# EAGLE design gt-jtx-2560 (EAGLE 8.2.2)
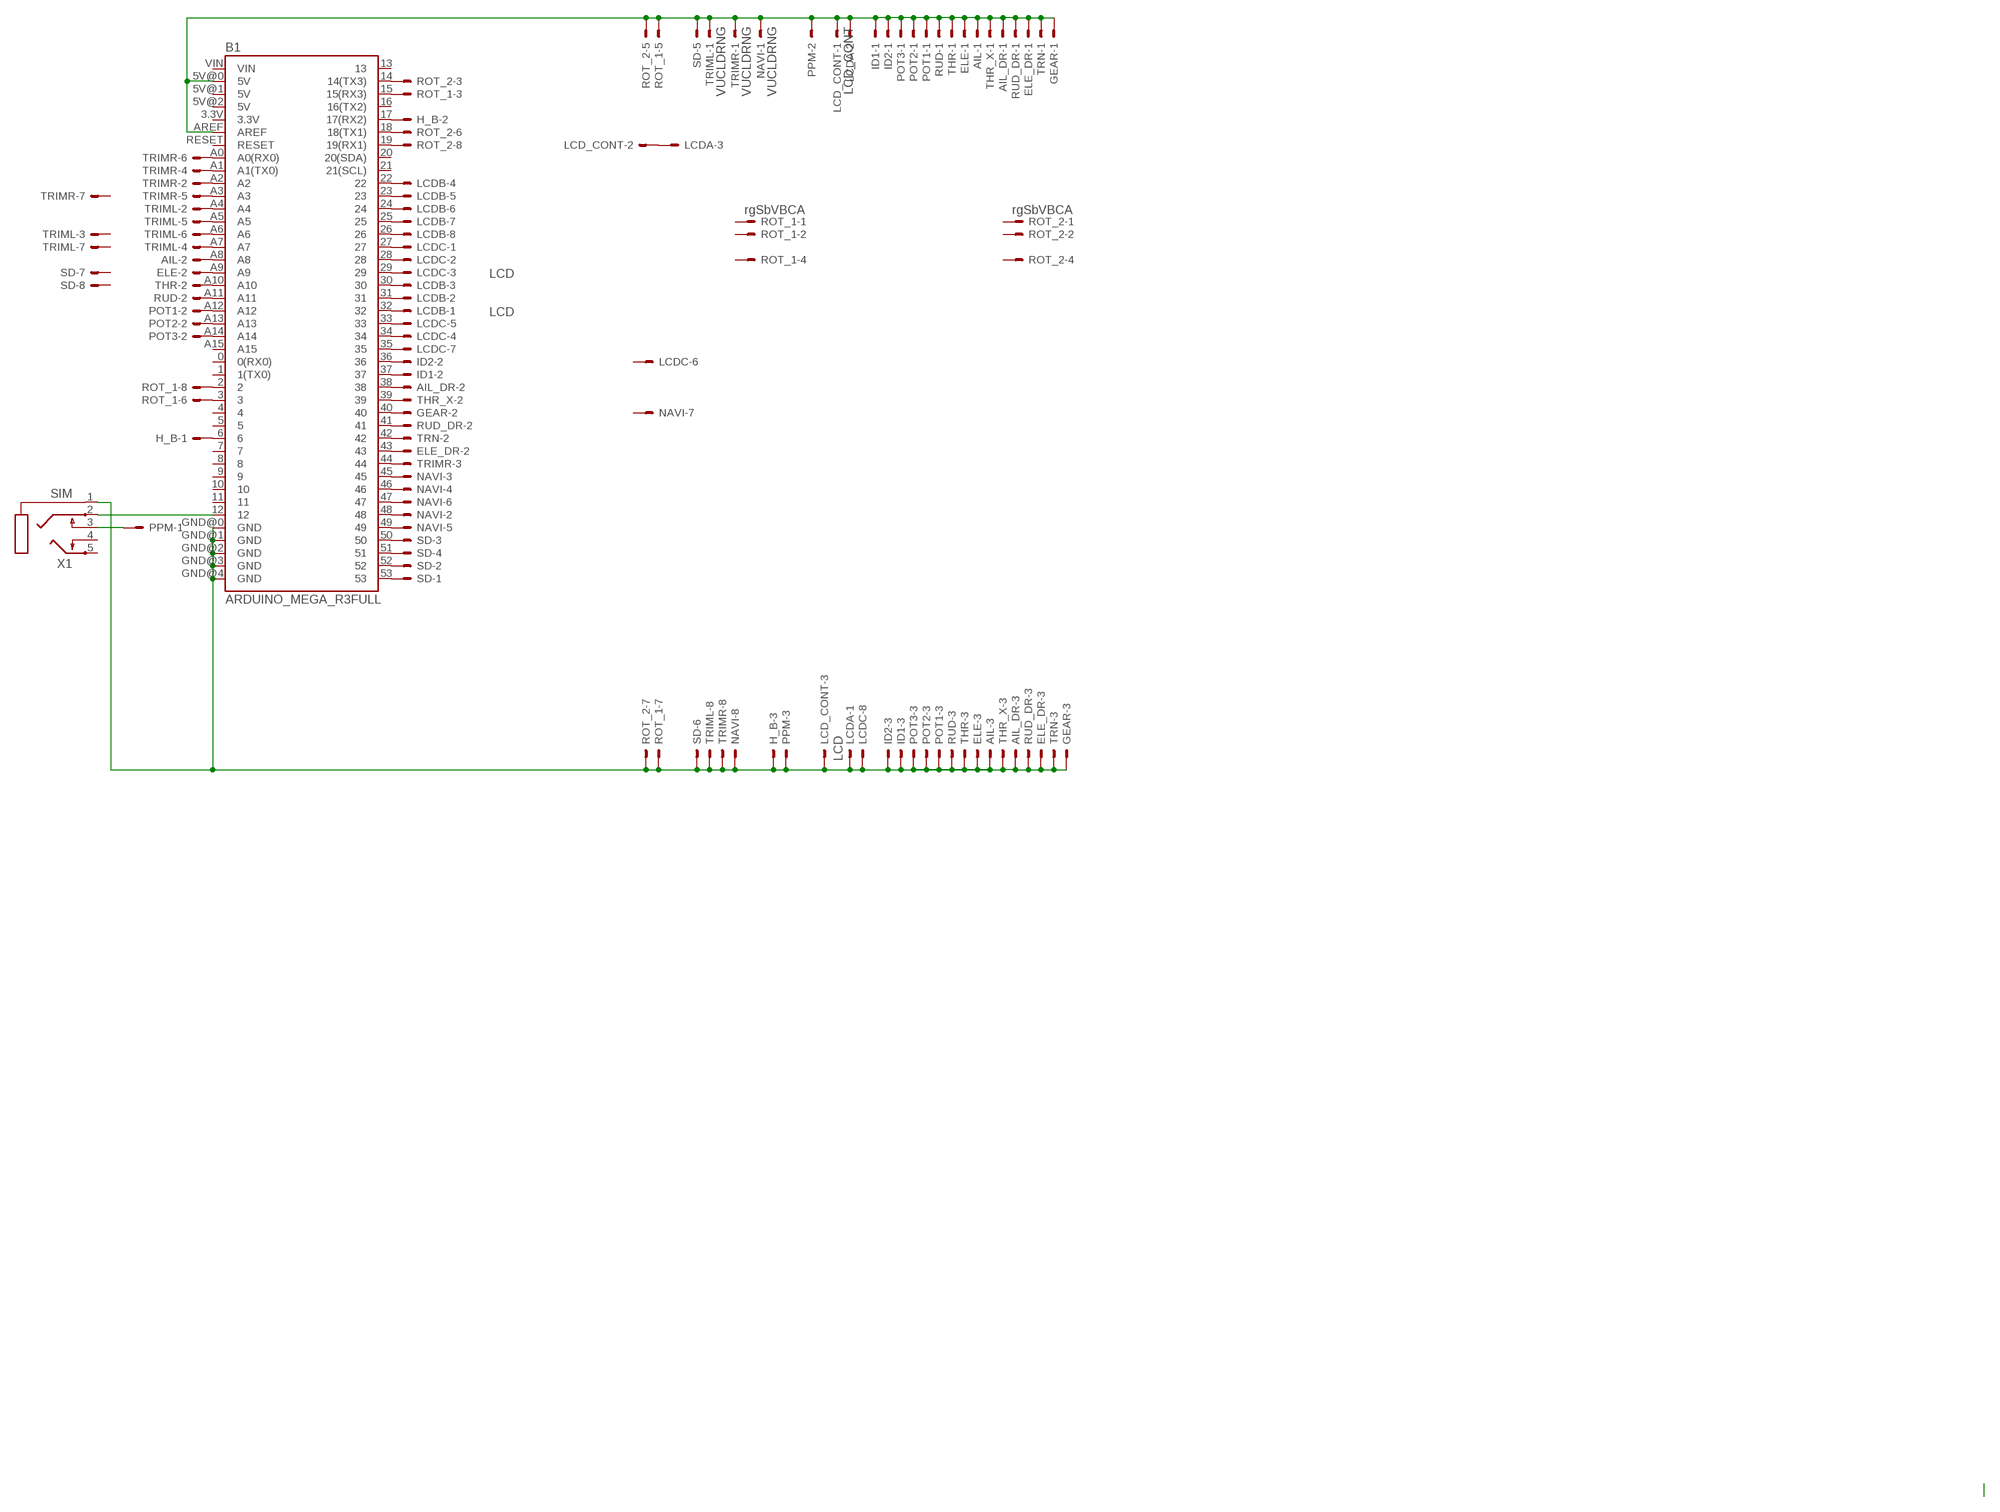
[diagram p0: schematic, sheet 1]

## Parts
AIL  JST-XH-03-PIN-LONG-PAD  [JST-XH-03-PACKAGE-LONG-PAD]
AIL_DR  JST-XH-03-PIN-LONG-PAD  [JST-XH-03-PACKAGE-LONG-PAD]
B1  ARDUINO_MEGA_R3FULL  [ARDUINO_MEGA]
ELE  JST-XH-03-PIN-LONG-PAD  [JST-XH-03-PACKAGE-LONG-PAD]
ELE_DR  JST-XH-03-PIN-LONG-PAD  [JST-XH-03-PACKAGE-LONG-PAD]
GEAR  JST-XH-03-PIN-LONG-PAD  [JST-XH-03-PACKAGE-LONG-PAD]
H_B  JST-XH-03-PIN-LONG-PAD  [JST-XH-03-PACKAGE-LONG-PAD]
ID1  JST-XH-03-PIN-LONG-PAD  [JST-XH-03-PACKAGE-LONG-PAD]
ID2  JST-XH-03-PIN-LONG-PAD  [JST-XH-03-PACKAGE-LONG-PAD]
LCD_CONT  LCD_CONT  JST-XH-03-PIN-LONG-PAD  [JST-XH-03-PACKAGE-LONG-PAD]
LCDA  LCD  JST-XH-03-PIN-LONG-PAD  [JST-XH-03-PACKAGE-LONG-PAD]
LCDB  LCD  JST-XH-08-PIN-LONG-PAD  [JST-XH-08-PACKAGE-LONG-PAD]
LCDC  LCD  JST-XH-08-PIN-LONG-PAD  [JST-XH-08-PACKAGE-LONG-PAD]
NAVI  VUCLDRNG  JST-XH-08-PIN-LONG-PAD  [JST-XH-08-PACKAGE-LONG-PAD]
POT1  JST-XH-03-PIN-LONG-PAD  [JST-XH-03-PACKAGE-LONG-PAD]
POT2  JST-XH-03-PIN-LONG-PAD  [JST-XH-03-PACKAGE-LONG-PAD]
POT3  JST-XH-03-PIN-LONG-PAD  [JST-XH-03-PACKAGE-LONG-PAD]
PPM  JST-XH-03-PIN-LONG-PAD  [JST-XH-03-PACKAGE-LONG-PAD]
ROT_1  rgSbVBCA  JST-XH-08-PIN-LONG-PAD  [JST-XH-08-PACKAGE-LONG-PAD]
ROT_2  rgSbVBCA  JST-XH-08-PIN-LONG-PAD  [JST-XH-08-PACKAGE-LONG-PAD]
RUD  JST-XH-03-PIN-LONG-PAD  [JST-XH-03-PACKAGE-LONG-PAD]
RUD_DR  JST-XH-03-PIN-LONG-PAD  [JST-XH-03-PACKAGE-LONG-PAD]
SD  JST-XH-08-PIN-LONG-PAD  [JST-XH-08-PACKAGE-LONG-PAD]
THR  JST-XH-03-PIN-LONG-PAD  [JST-XH-03-PACKAGE-LONG-PAD]
THR_X  JST-XH-03-PIN-LONG-PAD  [JST-XH-03-PACKAGE-LONG-PAD]
TRIML  VUCLDRNG  JST-XH-08-PIN-LONG-PAD  [JST-XH-08-PACKAGE-LONG-PAD]
TRIMR  VUCLDRNG  JST-XH-08-PIN-LONG-PAD  [JST-XH-08-PACKAGE-LONG-PAD]
TRN  JST-XH-03-PIN-LONG-PAD  [JST-XH-03-PACKAGE-LONG-PAD]
X1  SIM  STEREOJACK  [STX3100]

## Nets
GND: AIL.3 AIL_DR.3 B1.GND@0(GND) B1.GND@1(GND) B1.GND@2(GND) B1.GND@3(GND) B1.GND@4(GND) ELE.3 ELE_DR.3 GEAR.3 H_B.3 ID1.3 ID2.3 LCD_CONT.3 LCDA.1 LCDC.8 NAVI.8 POT1.3 POT2.3 POT3.3 PPM.3 ROT_1.7 ROT_2.7 RUD.3 RUD_DR.3 SD.6 THR.3 THR_X.3 TRIML.8 TRIMR.8 TRN.3 X1.1
N$1: B1.22 LCDB.4
N$2: B1.23 LCDB.5
N$3: B1.24 LCDB.6
N$4: B1.25 LCDB.7
N$5: B1.26 LCDB.8
N$6: B1.27 LCDC.1
N$7: B1.28 LCDC.2
N$8: B1.29 LCDC.3
N$9: B1.48 NAVI.2
N$10: B1.45 NAVI.3
N$11: B1.46 NAVI.4
N$12: B1.49 NAVI.5
N$13: B1.47 NAVI.6
N$14: B1.A2 TRIMR.2
N$15: B1.A7 TRIML.4
N$16: B1.53 SD.1
N$17: B1.A5 TRIML.5
N$18: B1.44 TRIMR.3
N$19: AIL.2 B1.A8
N$20: B1.A9 ELE.2
N$21: B1.A10 THR.2
N$22: B1.A11 RUD.2
N$23: B1.A12 POT1.2
N$24: B1.A13 POT2.2
N$25: B1.A14 POT3.2
N$26: B1.52 SD.2
N$27: B1.A1(A1(TX0)) TRIMR.4
N$28: B1.A3 TRIMR.5
N$29: B1.50 SD.3
N$30: B1.51 SD.4
N$31: B1.15(15(RX3)) ROT_1.3
N$32: B1.6 H_B.1
N$33: B1.39 THR_X.2
N$34: B1.41 RUD_DR.2
N$35: B1.43 ELE_DR.2
N$36: AIL_DR.2 B1.38
N$37: B1.42 TRN.2
N$38: B1.40 GEAR.2
N$39: B1.12 X1.2
N$41: B1.17(17(RX2)) H_B.2
N$42: B1.A0(A0(RX0)) TRIMR.6
N$43: B1.30 LCDB.3
N$44: B1.31 LCDB.2
N$45: B1.A6 TRIML.6
N$46: B1.A4 TRIML.2
N$47: B1.14(14(TX3)) ROT_2.3
N$48: B1.2 ROT_1.8
N$49: B1.3 ROT_1.6
N$50: B1.19(19(RX1)) ROT_2.8
N$51: B1.18(18(TX1)) ROT_2.6
N$52: B1.32 LCDB.1
N$53: B1.34 LCDC.4
N$54: B1.33 LCDC.5
N$55: B1.35 LCDC.7
N$56: LCD_CONT.2 LCDA.3
N$57: PPM.1 X1.3
N$59: B1.36 ID2.2
N$60: B1.37 ID1.2
VCC: AIL.1 AIL_DR.1 B1.5V@0(5V) B1.AREF ELE.1 ELE_DR.1 GEAR.1 ID1.1 ID2.1 LCD_CONT.1 LCDA.2 NAVI.1 POT1.1 POT2.1 POT3.1 PPM.2 ROT_1.5 ROT_2.5 RUD.1 RUD_DR.1 SD.5 THR.1 THR_X.1 TRIML.1 TRIMR.1 TRN.1
Unconnected: B1.0(0(RX0)) B1.1(1(TX0)) B1.3.3V B1.4 B1.5 B1.5V@1(5V) B1.5V@2(5V) B1.7 B1.8 B1.9 B1.10 B1.11 B1.13 B1.16(16(TX2)) B1.20(20(SDA)) B1.21(21(SCL)) B1.A15 B1.RESET B1.VIN LCDC.6 NAVI.7 ROT_1.1 ROT_1.2 ROT_1.4 ROT_2.1 ROT_2.2 ROT_2.4 SD.7 SD.8 TRIML.3 TRIML.7 TRIMR.7 X1.4 X1.5

## Library data of the parts
AIL AIL_DR ELE ELE_DR GEAR H_B ID1 ID2 LCD_CONT LCDA POT1-POT3 PPM RUD RUD_DR THR THR_X TRN = Rembrandt Electronics - JST XH Connectors v1-0:JST-XH-03-PIN: JST XH Connector 2 Pin Wire to board connector. Pitch: 2,54 mm, (0.100") Number of pins: 3 Created by Rembrandt Electronics www.rembrandtelectronics.com
B1 = SparkFun-Boards:ARDUINO_MEGA_R3: Arduino Mega R3 ATmega2560 R3 compatible footprint. SparkFun Products: Arduino Mega 2560 R3 <https://www.sparkfun.com/products/11061>
LCDB LCDC NAVI ROT_1 ROT_2 SD TRIML TRIMR = Rembrandt Electronics - JST XH Connectors v1-0:JST-XH-08-PIN: JST XH Connector 2 Pin Wire to board connector. Pitch: 2,54 mm, (0.100") Number of pins: 8 Created by Rembrandt Electronics www.rembrandtelectronics.com
X1 = adafruit:STEREOJACK: MIC/HEADPHONE JACK Stereo jack with two switches. Kycon STX3100, CUI SJ1-3555NG and/or 4UCon 05544

## Board
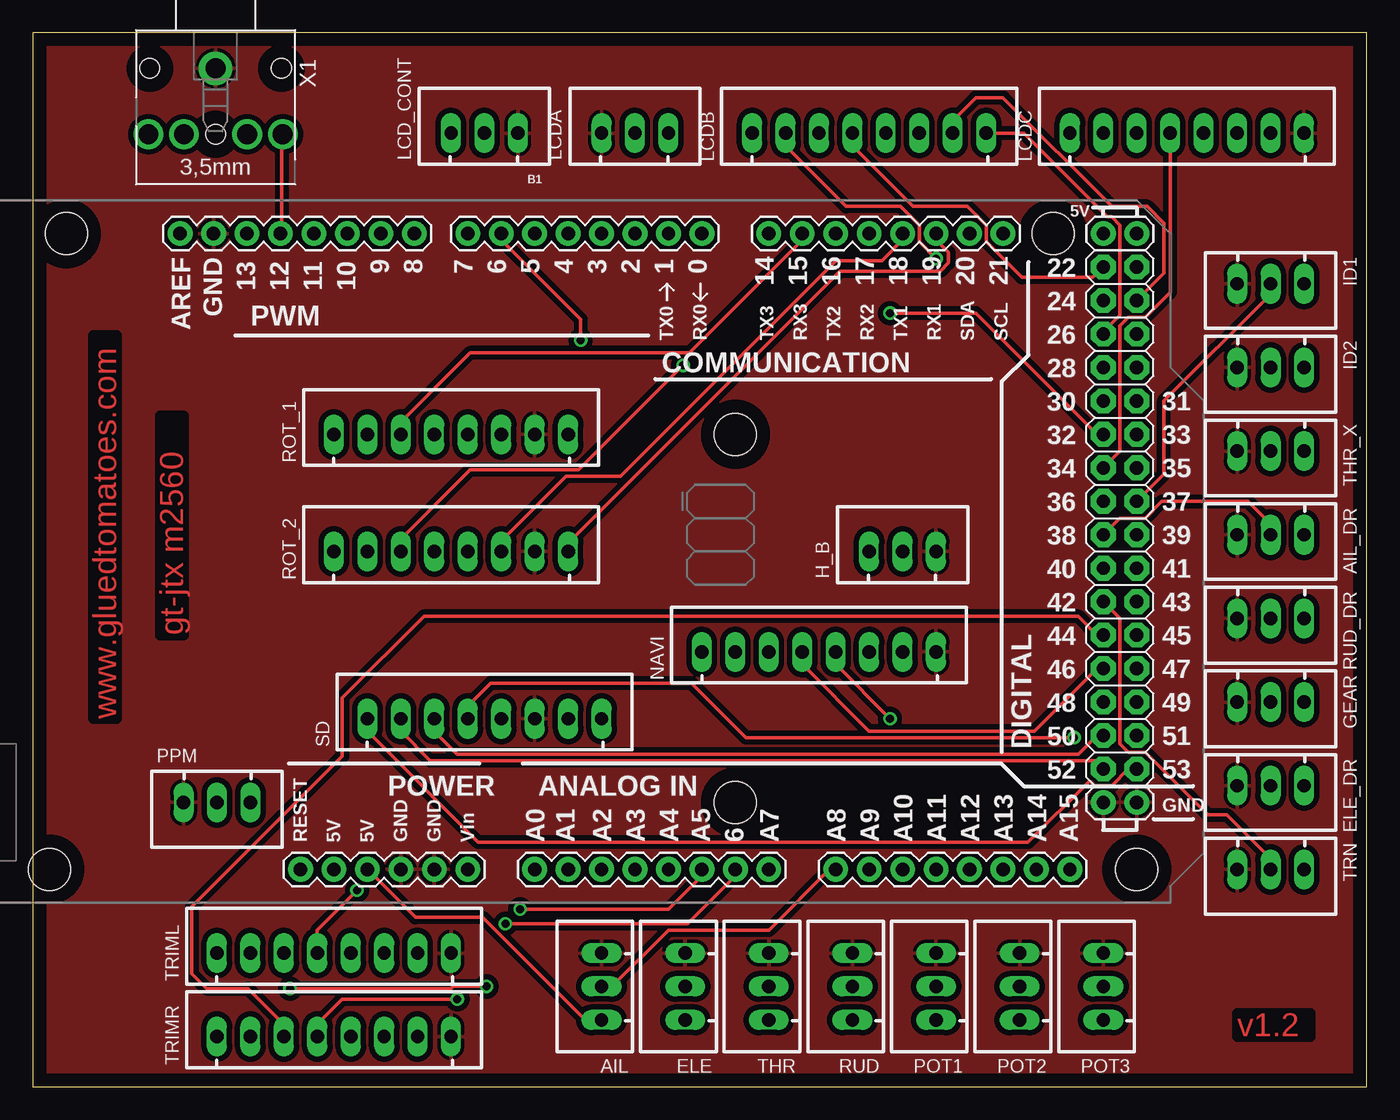
[diagram p1: board, top side]
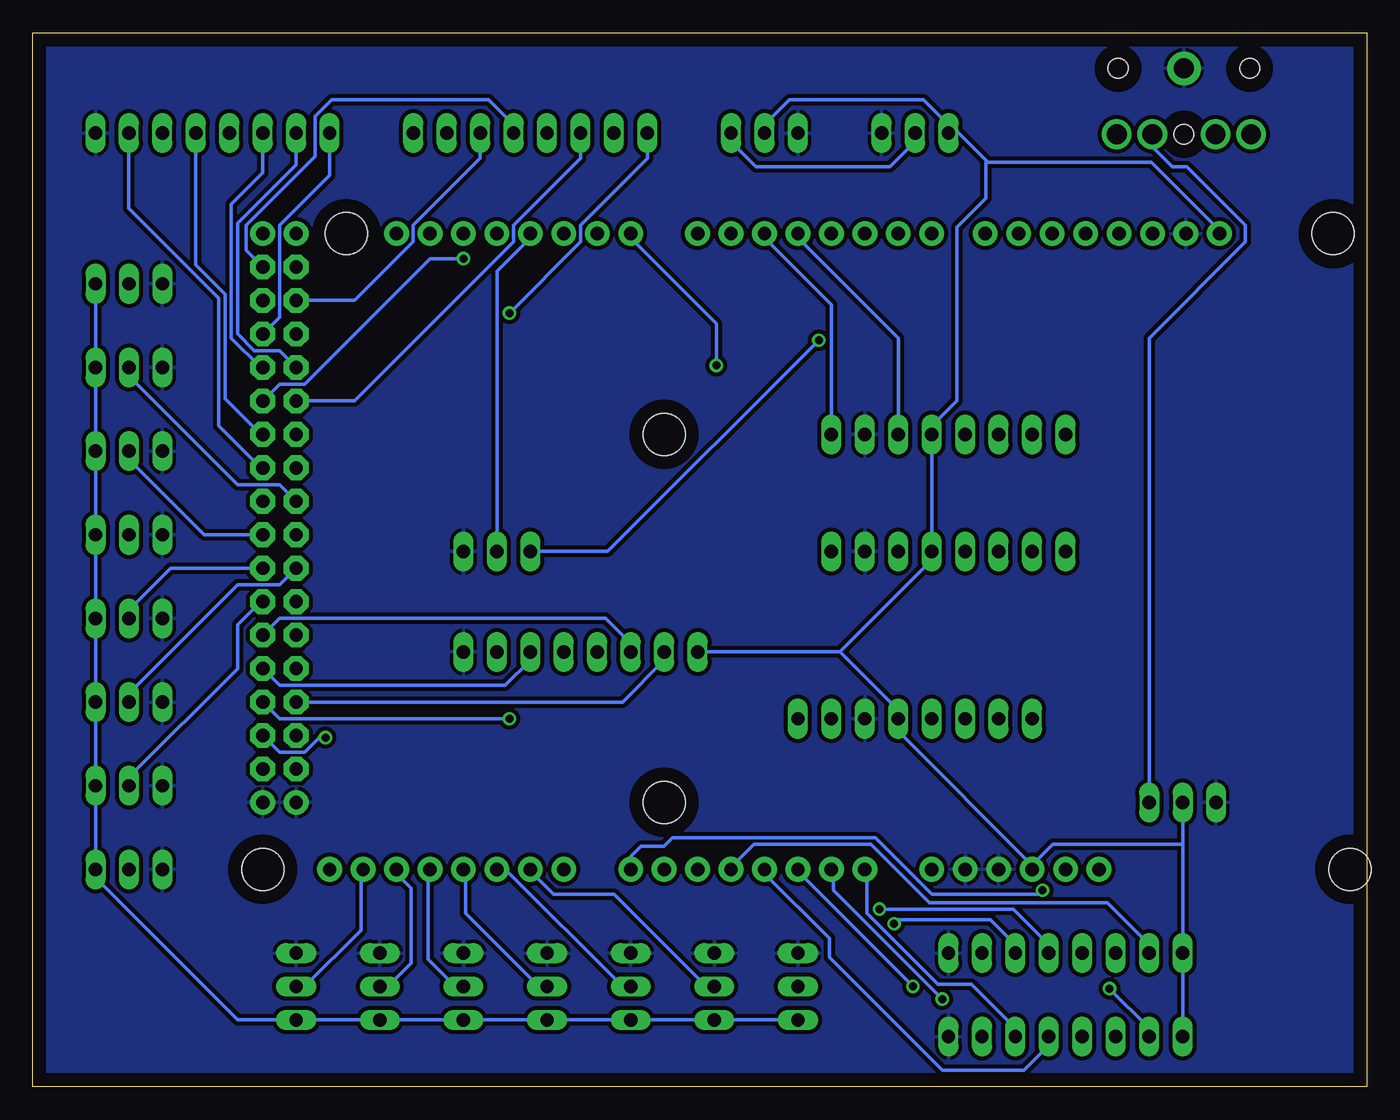
[diagram p2: board, bottom side, seen from below]

Size 101.27 x 80 mm. Coordinates in mm from the lower left corner, seen from the top.
Outline: 0,0 101.27,0 101.27,80 0,80 0,0
Copper layers (1*16): Top 0.035mm / dielectric 1.5mm / Bottom 0.035mm
Design rules "default": minimum track width 10mil, minimum drill 24mil, track to track 8mil, track to pad 8mil, pad to pad 8mil, via to via 8mil, smd to smd 8mil, copper to edge 40mil, drill to drill 8mil, minimum pad ring 10mil, minimum via ring 8mil, stop-mask expansion 4mil, vias tented up to drill 0mil, thermal gap 10mil

### Footprints (pad centres in the part's own frame; a part is rotated, then mirrored left to right if it is on the bottom)
JST-XH-03-PACKAGE-LONG-PAD = drill 1.016 long: 1 -2.54,0; 2 0,0; 3 2.54,0
ARDUINO_MEGA = drill 1.016 pad 1.88: 0 13.97,24.13; 1 11.43,24.13; 2 8.89,24.13; 3 6.35,24.13; 3.3V -13.97,-24.13; 4 3.81,24.13; 5 1.27,24.13; 5V@0 -11.43,-24.13; 5V@1 44.45,24.13; 5V@2 46.99,24.13; 6 -1.27,24.13; 7 -3.81,24.13; 8 -7.874,24.13; 9 -10.414,24.13; 10 -12.954,24.13; 11 -15.494,24.13; 12 -18.034,24.13; 13 -20.574,24.13; 14 19.05,24.13; 15 21.59,24.13; 16 24.13,24.13; 17 26.67,24.13; 18 29.21,24.13; 19 31.75,24.13; 20 34.29,24.13; 21 36.83,24.13; A0 1.27,-24.13; A1 3.81,-24.13; A2 6.35,-24.13; A3 8.89,-24.13; A4 11.43,-24.13; A5 13.97,-24.13; A6 16.51,-24.13; A7 19.05,-24.13; A8 24.13,-24.13; A9 26.67,-24.13; A10 29.21,-24.13; A11 31.75,-24.13; A12 34.29,-24.13; A13 36.83,-24.13; A14 39.37,-24.13; A15 41.91,-24.13; AREF -25.654,24.13; GND@0 -8.89,-24.13; GND@1 -6.35,-24.13; GND@2 44.45,-19.05; GND@3 46.99,-19.05; GND@4 -23.114,24.13; RESET -16.51,-24.13; VIN -3.81,-24.13 | drill 1.016 pad 1.88 octagon: 22 44.45,21.59; 23 46.99,21.59; 24 44.45,19.05; 25 46.99,19.05; 26 44.45,16.51; 27 46.99,16.51; 28 44.45,13.97; 29 46.99,13.97; 30 44.45,11.43; 31 46.99,11.43; 32 44.45,8.89; 33 46.99,8.89; 34 44.45,6.35; 35 46.99,6.35; 36 44.45,3.81; 37 46.99,3.81; 38 44.45,1.27; 39 46.99,1.27; 40 44.45,-1.27; 41 46.99,-1.27; 42 44.45,-3.81; 43 46.99,-3.81; 44 44.45,-6.35; 45 46.99,-6.35; 46 44.45,-8.89; 47 46.99,-8.89; 48 44.45,-11.43; 49 46.99,-11.43; 50 44.45,-13.97; 51 46.99,-13.97; 52 44.45,-16.51; 53 46.99,-16.51 | hole 3.2: -34.29,24.13; -35.56,-24.13; 16.51,8.89; 16.51,-19.05; 40.64,24.13; 46.99,-24.13
JST-XH-08-PACKAGE-LONG-PAD = drill 1.016 long: 1 -8.89,0; 2 -6.35,0; 3 -3.81,0; 4 -1.27,0; 5 1.27,0; 6 3.81,0; 7 6.35,0; 8 8.89,0
STX3100 = drill 1.5 pad 2.54: 1 2.7,-0.1 | drill 1.5: 2 7.7,5; 3 7.7,2.3; 4 7.7,-2.5; 5 7.7,-5.2 | hole 1.5: 2.7,4.9; 2.7,-5.1; 7.7,-0.1

### Placement (x,y rotation side)
AIL  43.18,7.62 90 top
AIL_DR  93.98,41.91 180 top
B1  36.83,40.64 0 top
ELE  49.53,7.62 90 top
ELE_DR  93.98,22.86 180 top
GEAR  93.98,29.21 180 top
H_B  66.04,40.64 0 top
ID1  93.98,60.96 180 top
ID2  93.98,54.61 180 top
LCD_CONT  34.29,72.39 0 top
LCDA  45.72,72.39 0 top
LCDB  63.5,72.39 0 top
LCDC  87.63,72.39 0 top
NAVI  59.69,33.02 0 top
POT1  68.58,7.62 90 top
POT2  74.93,7.62 90 top
POT3  81.28,7.62 90 top
PPM  13.97,21.59 180 top
ROT_1  31.75,49.53 0 top
ROT_2  31.75,40.64 0 top
RUD  62.23,7.62 90 top
RUD_DR  93.98,35.56 180 top
SD  34.29,27.94 0 top
THR  55.88,7.62 90 top
THR_X  93.98,48.26 180 top
TRIML  22.86,10.16 0 top
TRIMR  22.86,3.81 0 top
TRN  93.98,16.51 180 top
X1  13.97,80.01 270 top

### Tracks (layer width: path | path; a pad name or v marks a point on that pad's centre or on a via)
GND
  pour Top (isolate 0.406): 0,80.01 101.6,80.01 101.6,0 0,0
  pour Bottom (isolate 0.305): 0,80.01 101.6,80.01 101.6,0 0,0
N$1
  Top 0.254: LCDB.4 62.23,71.44 66.83,66.83 70.96,66.83 72.39,65.41 72.39,64.14 75.09,61.44 80.49,61.44 B1.22
N$2
  Bottom 0.254: LCDB.5 64.77,73.03 66.67,74.93 78.58,74.93 79.85,73.66 79.85,70.64 85.09,65.41 85.09,63.5 B1.23
N$3
  Bottom 0.254: LCDB.6 67.31,70.48 72.39,65.41 72.39,64.14 76.83,59.69 B1.24
N$4
  Top 0.254: LCDB.7 69.85,73.34 71.6,75.09 73.66,75.09 81.92,66.83 84.61,66.83 85.88,65.56 85.88,61.75 B1.25
N$5
  Top 0.254: LCDB.8 75.25,72.39 81.6,66.04 81.92,66.04 82.55,65.41 82.55,58.58 81.28,57.31 B1.26
N$6
  Bottom 0.254: LCDC.1 78.74,69.22 82.55,65.41 82.55,58.42 B1.27
N$7
  Bottom 0.254: LCDC.2 81.28,70.01 85.72,65.56 85.72,57.15 84.45,55.88 82.55,55.88 B1.28
N$8
  Bottom 0.254: LCDC.3 83.82,69.37 86.2,66.99 86.2,56.83 83.98,54.61 B1.29
N$9
  Bottom 0.254: NAVI.2 53.34,32.38 56.52,29.21 B1.48
N$10
  Bottom 0.254: NAVI.3 55.88,33.66 57.78,35.56 82.55,35.56 B1.45
N$11
  Top 0.254: NAVI.4 58.42,32.07 63.5,26.99 76.04,26.99 80.8,31.75 B1.46
N$12  (via drill 0.61)
  Top 0.254: NAVI.5 60.96,32.07 v65.09,27.94
  Bottom 0.254: v65.09,27.94 82.55,27.94 B1.49
N$13
  Bottom 0.254: NAVI.6 63.5,32.38 65.41,30.48 82.55,30.48 B1.47
N$14  (via drill 0.61)
  Top 0.254: v19.53,7.46 31.75,7.46 31.91,7.62 v34.45,7.62
  Bottom 0.254: TRIMR.2 16.51,4.45 v19.53,7.46 | v34.45,7.62 43.18,16.35 B1.A2
N$15  (via drill 0.61)
  Top 0.254: TRIML.4 21.59,11.91 v24.61,14.92
  Bottom 0.254: v24.61,14.92 24.92,14.61 33.02,14.61 37.31,18.89 52.7,18.89 53.34,18.26 55.09,18.26 55.88,17.46 B1.A7
N$16
  Top 0.254: SD.1 25.4,26.99 33.81,18.57 75.56,18.57 80.17,23.18 80.33,23.18 80.64,22.86 81.92,22.86 83.19,24.13 B1.53
N$17  (via drill 0.61)
  Top 0.254: v36.99,13.49 48.26,13.49 50.8,16.03 B1.A5
  Bottom 0.254: TRIML.5 24.13,10.79 26.83,13.49 v36.99,13.49
N$18
  Top 0.254: TRIMR.3 19.05,4.76 16.35,7.46 13.18,7.46 12.06,8.57 12.06,13.65 23.5,25.08 23.5,29.53 29.69,35.72 79.38,35.72 80.8,34.29 B1.44
N$19
  Top 0.254: AIL.2 43.97,7.62 48.26,11.91 55.88,11.91 60.48,16.51 B1.A8
N$20
  Bottom 0.254: ELE.2 50.16,7.62 57.15,14.61 61.75,14.61 63.5,16.35 B1.A9
N$21
  Bottom 0.254: THR.2 56.52,7.62 65.41,16.51 B1.A10
N$22
  Bottom 0.254: RUD.2 62.87,7.62 68.42,13.18 68.42,16.35 B1.A11
N$23
  Bottom 0.254: POT1.2 69.22,7.62 71.28,9.68 71.28,16.35 B1.A12
N$24
  Bottom 0.254: POT2.2 74.3,7.62 72.55,9.37 72.55,15.08 73.66,16.19 B1.A13
N$25
  Bottom 0.254: POT3.2 80.64,7.62 76.36,11.91 76.36,16.35 B1.A14
N$26
  Top 0.254: SD.2 27.94,26.99 30.16,24.77 80.64,24.77 B1.52
N$27  (via drill 0.61)
  Top 0.254: TRIMR.4 21.59,4.76 23.5,6.67 v32.23,6.67
  Bottom 0.254: v32.23,6.67 40.48,14.92 40.48,16.35 B1.A1
N$28
  Bottom 0.254: TRIMR.5 24.13,3.17 26.04,1.27 32.23,1.27 40.8,9.84 40.8,11.27 45.72,16.19 B1.A3
N$29
  Top 0.254: SD.3 30.48,26.99 32.23,25.24 79.38,25.24 80.8,26.67 B1.50
N$30  (via drill 0.61)
  Top 0.254: SD.4 33.02,28.89 34.77,30.64 50.01,30.64 54.13,26.51 v79.06,26.51
  Bottom 0.254: v79.06,26.51 79.53,26.51 80.64,25.4 82.55,25.4 B1.51
N$31
  Top 0.254: ROT_1.3 27.94,50.48 33.18,55.72 49.85,55.72 58.42,64.29 B1.15
N$32  (via drill 0.61)
  Top 0.254: v41.59,56.67 41.59,58.26 35.56,64.29 B1.6
  Bottom 0.254: H_B.1 57.63,40.64 v41.59,56.67
N$33
  Bottom 0.254: THR_X.2 93.98,47.62 88.27,41.91 B1.39
N$34
  Bottom 0.254: RUD_DR.2 93.98,36.2 90.81,39.37 B1.41
N$35
  Bottom 0.254: ELE_DR.2 93.98,23.5 85.72,31.75 85.72,35.08 83.98,36.83 B1.43
N$36
  Top 0.254: AIL_DR.2 93.98,42.7 92.23,44.45 85.72,44.45 84.45,43.18 82.55,43.18 B1.38
N$37
  Top 0.254: TRN.2 93.98,17.3 90.65,20.64 89.22,20.64 84.45,25.4 83.19,25.4 82.55,26.04 82.55,35.56 B1.42
N$38
  Bottom 0.254: GEAR.2 93.98,29.84 85.72,38.1 82.55,38.1 B1.40
N$39
  Top 0.254: B1.12 18.89,64.77 18.89,72.23 X1.2
N$41
  Bottom 0.254: H_B.2 66.04,61.91 63.5,64.45 B1.17
N$42
  Bottom 0.254: TRIMR.6 26.67,4.45 30,7.78 32.54,7.78 37.94,13.18 37.94,16.35 B1.A0
N$43
  Bottom 0.254: LCDB.3 59.69,70.48 64.77,65.41 64.77,64.14 76.83,52.07 B1.30
N$44  (via drill 0.61)
  Top 0.254: LCDB.2 57.15,71.44 61.75,66.83 65.88,66.83 67.31,65.41 67.31,64.14 v68.58,62.87
  Bottom 0.254: v68.58,62.87 71.12,62.87 80.64,53.34 82.55,53.34 B1.31
N$45  (via drill 0.61)
  Top 0.254: v35.88,12.38 49.69,12.38 53.34,16.03 B1.A6
  Bottom 0.254: TRIML.6 26.67,10.79 28.57,12.7 35.56,12.7 v35.88,12.38
N$46
  Bottom 0.254: TRIML.2 16.51,10.79 19.68,13.97 33.18,13.97 37.62,18.41 46.51,18.41 48.26,16.67 B1.A4
N$47  (via drill 0.61)
  Top 0.254: ROT_2.3 27.94,41.59 33.18,46.83 41.43,46.83 v49.37,54.77
  Bottom 0.254: v49.37,54.77 49.37,57.94 55.88,64.45 B1.14
N$48
  Bottom 0.254: ROT_1.8 40.64,59.37 45.72,64.45 B1.2
N$49
  Bottom 0.254: ROT_1.6 35.56,56.83 43.18,64.45 B1.3
N$50
  Top 0.254: ROT_2.8 40.64,41.27 61.28,61.91 68.9,61.91 69.53,62.55 69.53,63.34 68.58,64.29 B1.19
N$51
  Top 0.254: ROT_2.6 35.56,41.43 40.48,46.35 44.61,46.35 60.96,62.71 64.45,62.71 66.04,64.29 B1.18
N$52  (via drill 0.61)
  Top 0.254: v65.09,58.74 71.6,58.74 80.8,49.53 B1.32
  Bottom 0.254: LCDB.1 54.61,70.48 59.69,65.41 59.69,64.14 v65.09,58.74
N$53
  Top 0.254: LCDC.4 86.36,60.33 84.45,58.42 83.19,58.42 82.55,57.78 82.55,48.26 B1.34
N$54
  Bottom 0.254: LCDC.5 88.9,62.39 86.68,60.17 86.68,52.23 83.98,49.53 B1.33
N$55
  Bottom 0.254: LCDC.7 93.98,66.67 87.15,59.85 87.15,50.16 83.98,46.99 B1.35
N$56
  Bottom 0.254: LCD_CONT.2 34.29,71.75 36.2,69.85 46.35,69.85 48.26,71.75 LCDA.3
N$57
  Bottom 0.254: PPM.1 16.51,56.83 9.21,64.14 9.21,65.41 13.65,69.85 14.76,69.85 16.19,71.28 16.19,72.23 X1.3
N$59
  Bottom 0.254: ID2.2 93.98,53.98 85.72,45.72 82.55,45.72 B1.36
N$60
  Top 0.254: ID1.2 93.98,60.17 85.88,52.07 85.88,46.51 B1.37
VCC
  Top 0.254: B1.5V@0 29.05,12.86 34.13,12.86 41.91,5.08 AIL.1
  Bottom 0.254: LCDA.2 45.72,73.03 43.81,74.93 33.66,74.93 31.75,73.03 LCD_CONT.1 31.75,73.18 28.81,70.25 | 28.81,70.25 28.73,70.17 16.35,70.17 11.27,65.09 11.27,64.77 B1.AREF | TRIMR.1 TRIML.1 13.97,18.41 | 13.97,18.41 PPM.2 | 25.4,16.83 35.56,26.99 SD.5 35.56,28.57 40.01,33.02 | 40.01,33.02 NAVI.1 | 40.01,33.02 33.02,40.01 ROT_2.5 ROT_1.5 33.02,50.16 31.11,52.07 31.11,65.25 28.89,67.47 28.89,70.17 28.81,70.25 | 13.97,18.41 23.81,18.41 25.4,16.83 | 25.4,16.83 B1.5V@0 | AIL.1 ELE.1 THR.1 RUD.1 POT1.1 POT2.1 POT3.1 85.72,5.08 96.52,15.88 TRN.1 ELE_DR.1 GEAR.1 RUD_DR.1 AIL_DR.1 THR_X.1 ID2.1 ID1.1

### Text on the board
Top: gt-jtx m2560 | www.gluedtomatoes.com | v1.2